# Altium schematic sheet EEG_CON.SchDoc
size A4
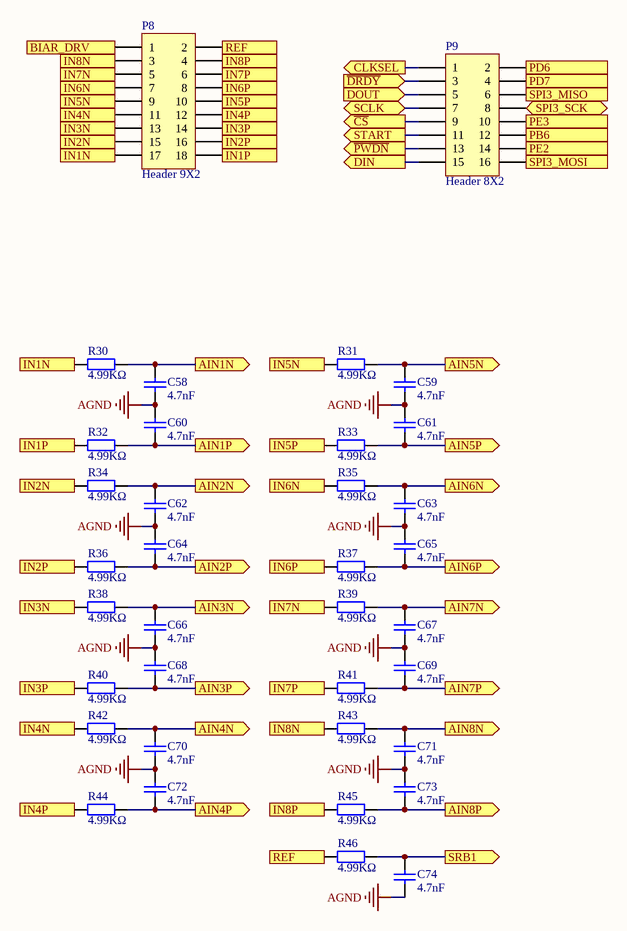
[diagram p0: EEG_CON.SchDoc]

## Parts
C58  4.7nF  [0603_C]
C59  4.7nF  [0603_C]
C60  4.7nF  [0603_C]
C61  4.7nF  [0603_C]
C62  4.7nF  [0603_C]
C63  4.7nF  [0603_C]
C64  4.7nF  [0603_C]
C65  4.7nF  [0603_C]
C66  4.7nF  [0603_C]
C67  4.7nF  [0603_C]
C68  4.7nF  [0603_C]
C69  4.7nF  [0603_C]
C70  4.7nF  [0603_C]
C71  4.7nF  [0603_C]
C72  4.7nF  [0603_C]
C73  4.7nF  [0603_C]
C74  4.7nF  [0603_C]
P8  Header 9X2  [HDR2X9]
P9  Header 8X2  [HDR2X8]
R30  4.99KΩ  [0603_R]
R31  4.99KΩ  [0603_R]
R32  4.99KΩ  [0603_R]
R33  4.99KΩ  [0603_R]
R34  4.99KΩ  [0603_R]
R35  4.99KΩ  [0603_R]
R36  4.99KΩ  [0603_R]
R37  4.99KΩ  [0603_R]
R38  4.99KΩ  [0603_R]
R39  4.99KΩ  [0603_R]
R40  4.99KΩ  [0603_R]
R41  4.99KΩ  [0603_R]
R42  4.99KΩ  [0603_R]
R43  4.99KΩ  [0603_R]
R44  4.99KΩ  [0603_R]
R45  4.99KΩ  [0603_R]
R46  4.99KΩ  [0603_R]

## Ports
AIN1N (out), AIN1P (out), AIN2N (out), AIN2P (out), AIN3N (out), AIN3P (out), AIN4N (out), AIN4P (out), AIN5N (out), AIN5P (out), AIN6N (out), AIN6P (out), AIN7N (out), AIN7P (out), AIN8N (out), AIN8P (out), BIAR_DRV (out), CLKSEL (out), DIN (out), DOUT (in), IN1N (in), IN1N (out), IN1P (in), IN1P (out), IN2N (in), IN2N (out), IN2P (in), IN2P (out), IN3N (in), IN3N (out), IN3P (in), IN3P (out), IN4N (in), IN4N (out), IN4P (in), IN4P (out), IN5N (in), IN5N (out), IN5P (in), IN5P (out), IN6N (in), IN6N (out), IN6P (in), IN6P (out), IN7N (in), IN7N (out), IN7P (in), IN7P (out), IN8N (in), IN8N (out), IN8P (in), IN8P (out), PB6 (in), PD6 (in), PD7 (out), PE2 (in), PE3 (in), REF (in), REF (out), SCLK (bidir), SPI3_MISO (out), SPI3_MOSI (in), SPI3_SCK (bidir), SRB1 (out), START (out), ~{CS} (out), ~{DRDY} (in), ~{PWDN} (out)

## Nets
AGND: C58.1 C59.1 C60.2 C61.2 C62.1 C63.1 C64.2 C65.2 C66.1 C67.1 C68.2 C69.2 C70.1 C71.1 C72.2 C73.2 C74.1
AIN1N: C58.2 R30.2 ; port AIN1N
AIN1P: C60.1 R32.2 ; port AIN1P
AIN2N: C62.2 R34.2 ; port AIN2N
AIN2P: C64.1 R36.2 ; port AIN2P
AIN3N: C66.2 R38.2 ; port AIN3N
AIN3P: C68.1 R40.2 ; port AIN3P
AIN4N: C70.2 R42.2 ; port AIN4N
AIN4P: C72.1 R44.2 ; port AIN4P
AIN5N: C59.2 R31.2 ; port AIN5N
AIN5P: C61.1 R33.2 ; port AIN5P
AIN6N: C63.2 R35.2 ; port AIN6N
AIN6P: C65.1 R37.2 ; port AIN6P
AIN7N: C67.2 R39.2 ; port AIN7N
AIN7P: C69.1 R41.2 ; port AIN7P
AIN8N: C71.2 R43.2 ; port AIN8N
AIN8P: C73.1 R45.2 ; port AIN8P
BIAR_DRV: P8.1 ; port BIAR_DRV
~{CS}: P9.9 ; port ~{CS}
CLKSEL: P9.1 ; port CLKSEL
~{DRDY}: P9.3 ; port ~{DRDY}
DIN: P9.15 ; port DIN
DOUT: P9.5 ; port DOUT
IN1N: P8.17 R30.1 ; port IN1N
IN1P: P8.18 R32.1 ; port IN1P
IN2N: P8.15 R34.1 ; port IN2N
IN2P: P8.16 R36.1 ; port IN2P
IN3N: P8.13 R38.1 ; port IN3N
IN3P: P8.14 R40.1 ; port IN3P
IN4N: P8.11 R42.1 ; port IN4N
IN4P: P8.12 R44.1 ; port IN4P
IN5N: P8.9 R31.1 ; port IN5N
IN5P: P8.10 R33.1 ; port IN5P
IN6N: P8.7 R35.1 ; port IN6N
IN6P: P8.8 R37.1 ; port IN6P
IN7N: P8.5 R39.1 ; port IN7N
IN7P: P8.6 R41.1 ; port IN7P
IN8N: P8.3 R43.1 ; port IN8N
IN8P: P8.4 R45.1 ; port IN8P
~{PWDN}: P9.13 ; port ~{PWDN}
PB6: P9.12 ; port PB6
PD6: P9.2 ; port PD6
PD7: P9.4 ; port PD7
PE2: P9.14 ; port PE2
PE3: P9.10 ; port PE3
REF: P8.2 R46.1 ; port REF
SCLK: P9.7 ; port SCLK
SPI3_MISO: P9.6 ; port SPI3_MISO
SPI3_MOSI: P9.16 ; port SPI3_MOSI
SPI3_SCK: P9.8 ; port SPI3_SCK
SRB1: C74.2 R46.2 ; port SRB1
START: P9.11 ; port START

## Library data of the parts
C58-C74 = 0402 4.7nF (472) 10% 50V: 贴片电容; ComponentLink1Description: 供应商链接; ComponentLink1URL: http://www.szlcsc.com/product/details_1890.html; Package: 0402; Supplier: LC; SuppliersPartNumber: C1538
P8 = Header 9X2: Header, 9-Pin, Dual row; LatestRevisionDate: 17-Jul-2002; LatestRevisionNote: Re-released for DXP Platform.; Publisher: Altium Limited
P9 = Header 8X2: Header, 8-Pin, Dual row; LatestRevisionDate: 17-Jul-2002; LatestRevisionNote: Re-released for DXP Platform.; Publisher: Altium Limited
R30-R46 = 0603 4.99KΩ (4991) 1%: 贴片电阻; ComponentLink1Description: 供应商链接; ComponentLink1URL: http://www.szlcsc.com/product/details_23773.html; Package: 0603; Supplier: LC; SuppliersPartNumber: C23046